# Altium schematic sheet Power ATX.SchDoc
size A3; SheetNumber: 2; SheetTotal: 15
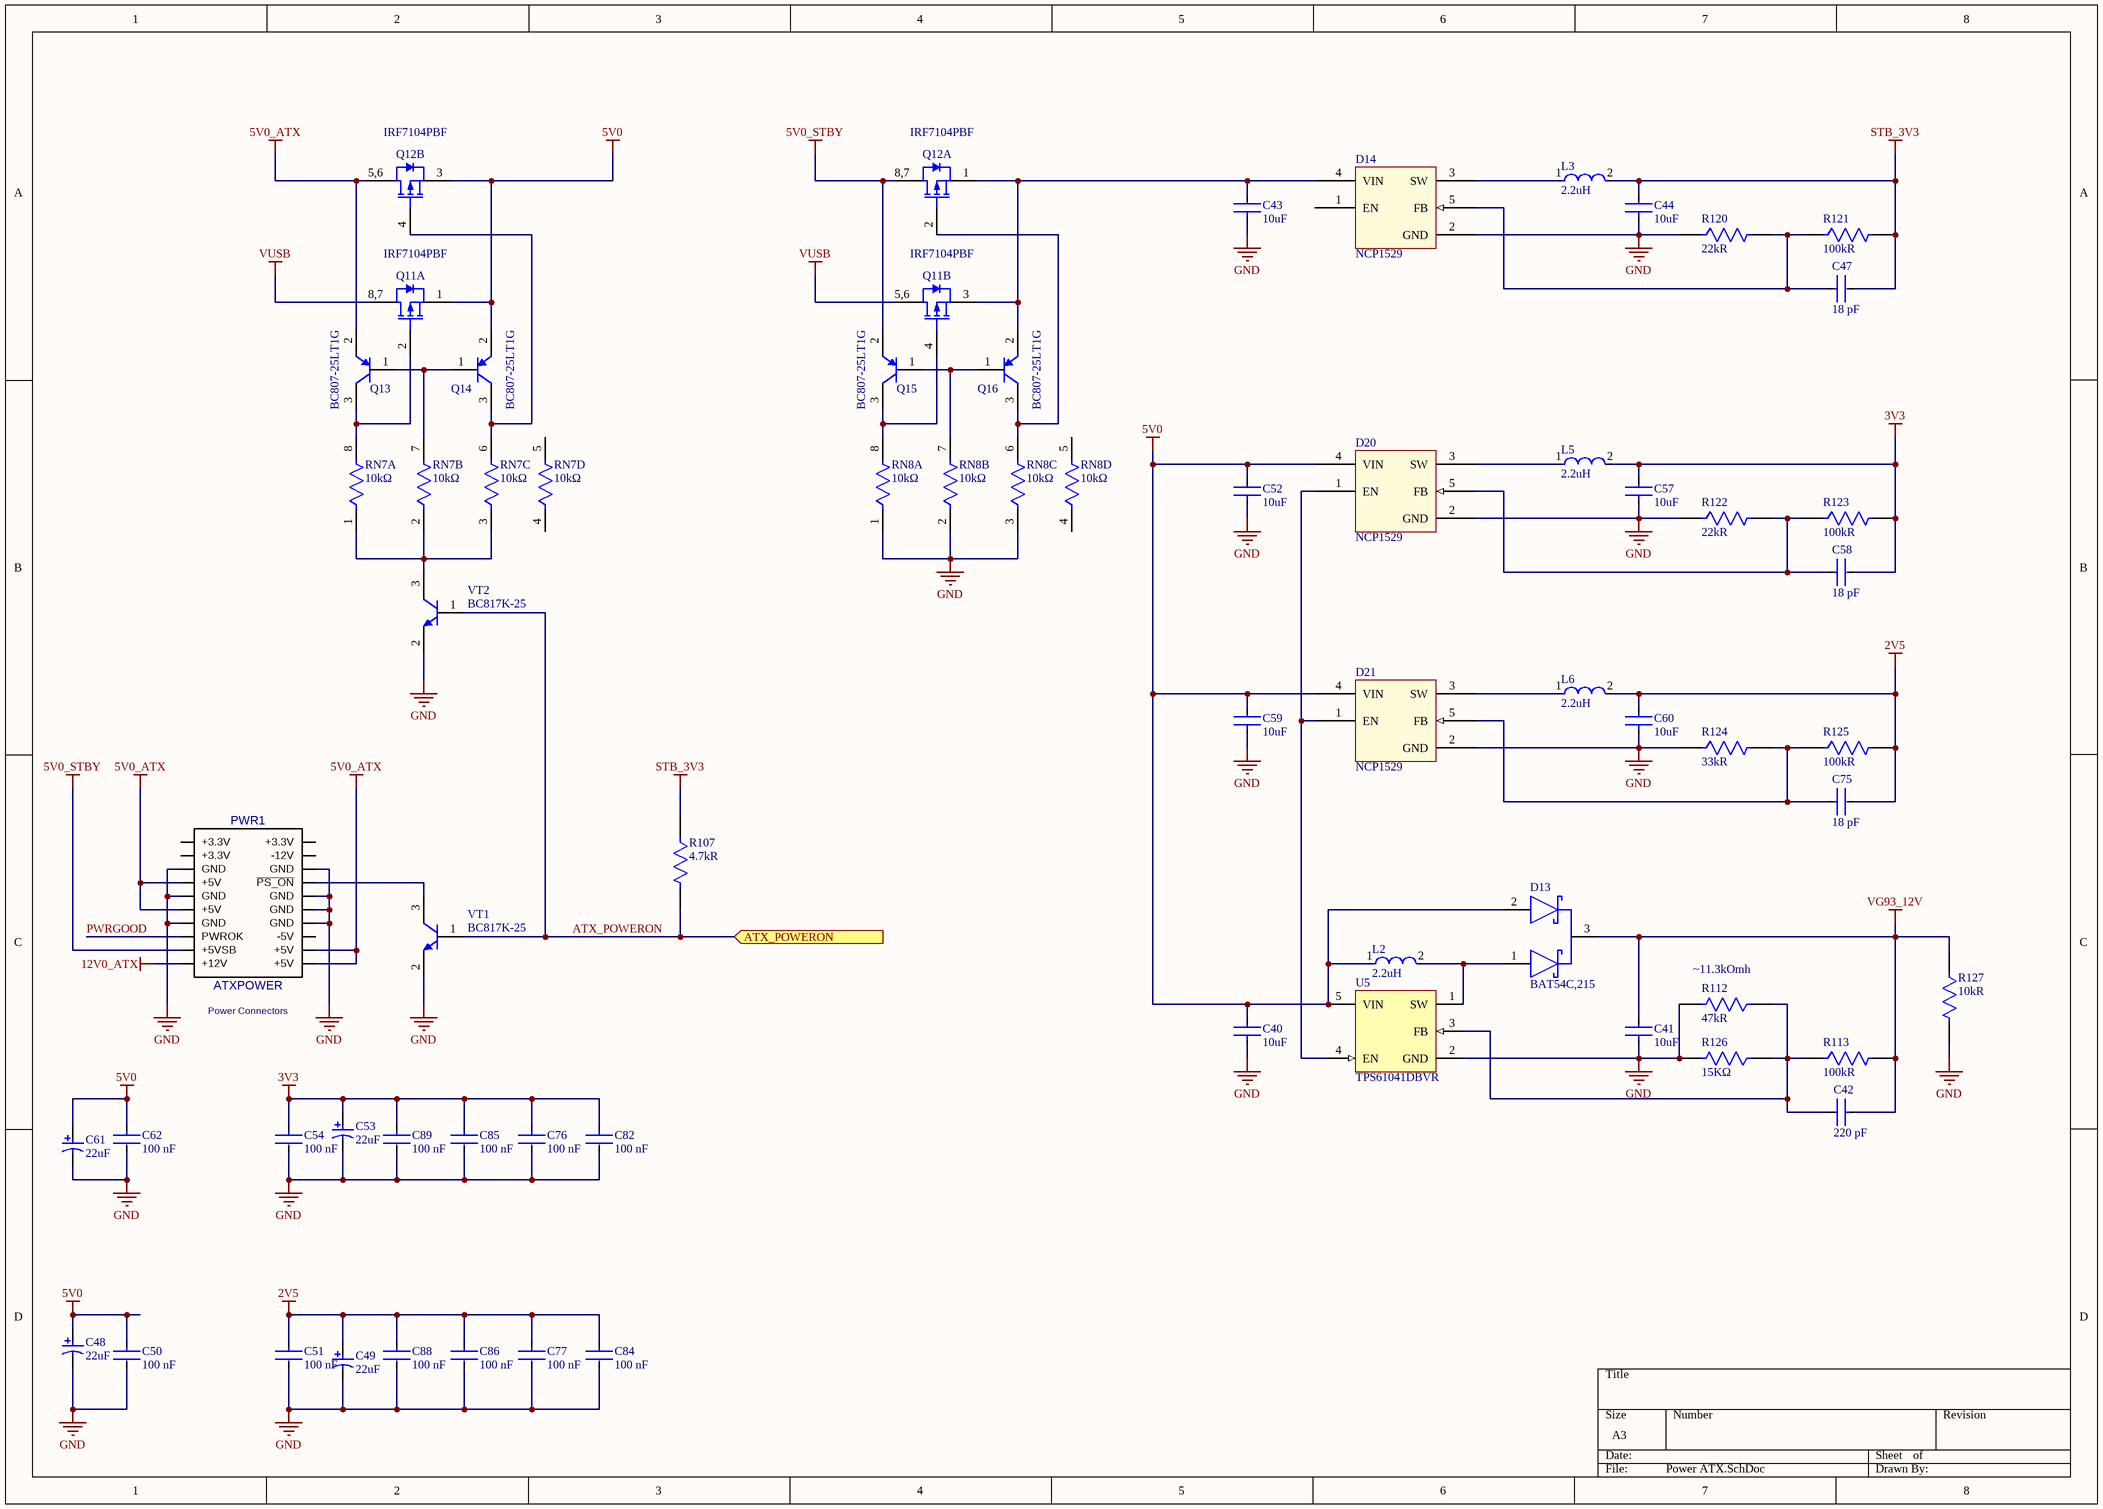
[diagram p0: Power ATX.SchDoc]

## Parts
C40  Capacitance: 10uF  [FP-C0805C-DG-IPC_A]  (hidden comment: C0805C106K8PACTU)
C41  Capacitance: 10uF  [FP-C0805C-DG-IPC_A]  (hidden comment: C0805C106K8PACTU)
C42  Capacitance: 220 pF  [FP-CC0805-0_85-IPC_A]  (hidden comment: CC0805KRX7R9BB221)
C43  Capacitance: 10uF  [FP-C0805C-DG-IPC_A]  (hidden comment: C0805C106K8PACTU)
C44  Capacitance: 10uF  [FP-C0805C-DG-IPC_A]  (hidden comment: C0805C106K8PACTU)
C47  Capacitance: 18 pF  [FP-C0805C-DN-IPC_A]  (hidden comment: C0805C180J5GACTU)
C48  Capacitance: 22uF  [AVX-TAJ-B-2_M]  (hidden comment: TAJB226K016RNJ)
C49  Capacitance: 22uF  [AVX-TAJ-B-2_M]  (hidden comment: TAJB226K016RNJ)
C50  Capacitance: 100 nF  [FP-CC0805-0_85-IPC_A]  (hidden comment: CC0805KRX7R9BB104)
C51  Capacitance: 100 nF  [FP-CC0805-0_85-IPC_A]  (hidden comment: CC0805KRX7R9BB104)
C52  Capacitance: 10uF  [FP-C0805C-DG-IPC_A]  (hidden comment: C0805C106K8PACTU)
C53  Capacitance: 22uF  [AVX-TAJ-B-2_M]  (hidden comment: TAJB226K016RNJ)
C54  Capacitance: 100 nF  [FP-CC0805-0_85-IPC_A]  (hidden comment: CC0805KRX7R9BB104)
C57  Capacitance: 10uF  [FP-C0805C-DG-IPC_A]  (hidden comment: C0805C106K8PACTU)
C58  Capacitance: 18 pF  [FP-C0805C-DN-IPC_A]  (hidden comment: C0805C180J5GACTU)
C59  Capacitance: 10uF  [FP-C0805C-DG-IPC_A]  (hidden comment: C0805C106K8PACTU)
C60  Capacitance: 10uF  [FP-C0805C-DG-IPC_A]  (hidden comment: C0805C106K8PACTU)
C61  Capacitance: 22uF  [AVX-TAJ-B-2_M]  (hidden comment: TAJB226K016RNJ)
C62  Capacitance: 100 nF  [FP-CC0805-0_85-IPC_A]  (hidden comment: CC0805KRX7R9BB104)
C75  Capacitance: 18 pF  [FP-C0805C-DN-IPC_A]  (hidden comment: C0805C180J5GACTU)
C76  Capacitance: 100 nF  [FP-CC0805-0_85-IPC_A]  (hidden comment: CC0805KRX7R9BB104)
C77  Capacitance: 100 nF  [FP-CC0805-0_85-IPC_A]  (hidden comment: CC0805KRX7R9BB104)
C82  Capacitance: 100 nF  [FP-CC0805-0_85-IPC_A]  (hidden comment: CC0805KRX7R9BB104)
C84  Capacitance: 100 nF  [FP-CC0805-0_85-IPC_A]  (hidden comment: CC0805KRX7R9BB104)
C85  Capacitance: 100 nF  [FP-CC0805-0_85-IPC_A]  (hidden comment: CC0805KRX7R9BB104)
C86  Capacitance: 100 nF  [FP-CC0805-0_85-IPC_A]  (hidden comment: CC0805KRX7R9BB104)
C88  Capacitance: 100 nF  [FP-CC0805-0_85-IPC_A]  (hidden comment: CC0805KRX7R9BB104)
C89  Capacitance: 100 nF  [FP-CC0805-0_85-IPC_A]  (hidden comment: CC0805KRX7R9BB104)
D13  BAT54C,215  [FP-SOT23-MFG]
D14  NCP1529  [TSOP-95-5N]
D20  NCP1529  [TSOP-95-5N]
D21  NCP1529  [TSOP-95-5N]
L2  Inductance: 2.2uH  [FP-DFE252012C-MFG]  (hidden comment: DFE252012P-2R2M=P2)
L3  Inductance: 2.2uH  [FP-DFE252012C-MFG]  (hidden comment: DFE252012P-2R2M=P2)
L5  Inductance: 2.2uH  [FP-DFE252012C-MFG]  (hidden comment: DFE252012P-2R2M=P2)
L6  Inductance: 2.2uH  [FP-DFE252012C-MFG]  (hidden comment: DFE252012P-2R2M=P2)
PWR1  ATXPOWER  [ATXPOWER]
Q11  IRF7104PBF  [SOIC127P600X155-8N]  (parts A,B of 2)
Q12  IRF7104PBF  [SOIC127P600X155-8N]  (parts A,B of 2)
Q13  BC807-25LT1G  [ONSC-SOT-23-3-318-08_V]
Q14  BC807-25LT1G  [ONSC-SOT-23-3-318-08_V]
Q15  BC807-25LT1G  [ONSC-SOT-23-3-318-08_V]
Q16  BC807-25LT1G  [ONSC-SOT-23-3-318-08_V]
R107  Resistance: 4.7kR  [FP-CR0805-IPC_A]  (hidden comment: CR0805-JW-472ELF)
R112  Resistance: 47kR  [FP-CRCW0805-HPe3-IPC_A]  (hidden comment: CRCW080547K0FKEAHP)
R113  Resistance: 100kR  [FP-ERA6A-IPC_A]  (hidden comment: ERA-6AEB104V)
R120  Resistance: 22kR  [FP-CRCW0805-e3-IPC_A]  (hidden comment: CRCW080522K0JNEA)
R121  Resistance: 100kR  [FP-ERA6A-IPC_A]  (hidden comment: ERA-6AEB104V)
R122  Resistance: 22kR  [FP-CRCW0805-e3-IPC_A]  (hidden comment: CRCW080522K0JNEA)
R123  Resistance: 100kR  [FP-ERA6A-IPC_A]  (hidden comment: ERA-6AEB104V)
R124  Resistance: 33kR  [FP-RMCF0805-IPC_A]  (hidden comment: RMCF0805JT33K0)
R125  Resistance: 100kR  [FP-ERA6A-IPC_A]  (hidden comment: ERA-6AEB104V)
R126  Resistance: 15KΩ  [FP-RN732A-IPC_A]  (hidden comment: RN73C2A15KBTDF)
R127  Resistance: 10kR  [FP-CR0805-IPC_A]  (hidden comment: CR0805-JW-103ELF)
RN7  Resistance: 10kΩ  [FP-CAT16-F4-MFG]  (hidden comment: CAT16-1002F4LF)  (parts A,B,C,D of 4)
RN8  Resistance: 10kΩ  [FP-CAT16-F4-MFG]  (hidden comment: CAT16-1002F4LF)  (parts A,B,C,D of 4)
U5  TPS61041DBVR  [DBV0005A_M]
VT1  BC817K-25  [INF-SOT23_N]
VT2  BC817K-25  [INF-SOT23_N]

## Ports
ATX_POWERON (in)

## Nets
2V5: C49.1 C51.1 C60.2 C75.2 C77.1 C84.1 C86.1 C88.1 L6.2 R125.2
3V3: C53.1 C54.1 C57.2 C58.2 C76.1 C82.1 C85.1 C89.1 L5.2 R123.2
5V0: C40.2 C48.1 C50.1 C52.2 C59.2 C61.1 C62.1 D13.2(2_ANODE) D20.4(VIN) D21.4(VIN) L2.1 Q11.1(SOURCE) Q12.3(SOURCE) Q14.2(E) U5.5(VIN)
5V0_ATX: PWR1.4(+5V) PWR1.6(+5V) PWR1.19(+5V) PWR1.20(+5V) Q12.5,6(DRAIN) Q13.2(E)
5V0_STBY: PWR1.9(+5VSB) Q12.8,7(DRAIN) Q15.2(E)
12V0_ATX: PWR1.10(+12V)
GND: C40.1 C41.1 C43.1 C44.1 C48.2 C49.2 C50.2 C51.2 C52.1 C53.2 C54.2 C57.1 C59.1 C60.1 C61.2 C62.2 C76.2 C77.2 C82.2 C84.2 C85.2 C86.2 C88.2 C89.2 D14.2(GND) D20.2(GND) D21.2(GND) PWR1.3(GND) PWR1.5(GND) PWR1.7(GND) PWR1.13(GND) PWR1.15(GND) PWR1.16(GND) PWR1.17(GND) R112.2 R120.1 R122.1 R124.1 R126.2 R127.2 RN8.1 RN8.2 RN8.3 U5.2(GND) VT1.2(E) VT2.2(E)
STB_3V3: C44.2 C47.2 L3.2 R107.1 R121.2
VG93_12V: C41.2 C42.1 D13.3(COMMON_CATHODE) R113.2 R127.1
VUSB: Q11.5,6(DRAIN) Q11.8,7(DRAIN)
ATX_POWERON: R107.2 VT1.1(B) VT2.1(B) ; port ATX_POWERON
PWRGOOD: PWR1.8(PWROK)
NetC42_2: C42.2 R112.1 R113.1 R126.1 U5.3(FB)
NetC43_2: C43.2 D14.4(VIN) Q11.3(SOURCE) Q12.1(SOURCE) Q16.2(E)
NetC47_1: C47.1 D14.5(FB) R120.2 R121.1
NetC58_1: C58.1 D20.5(FB) R122.2 R123.1
NetC75_1: C75.1 D21.5(FB) R124.2 R125.1
NetD13_1: D13.1(1_ANODE) L2.2 U5.1(SW)
NetD14_3: D14.3(SW) L3.1
NetD20_1: D20.1(EN) D21.1(EN) U5.4(EN)
NetD20_3: D20.3(SW) L5.1
NetD21_3: D21.3(SW) L6.1
NetPWR1_14: PWR1.14(~{PS_ON}) VT1.3(C)
NetQ11_2: Q11.2(GATE) Q13.3(C) RN7.8
NetQ11_4: Q11.4(GATE) Q15.3(C) RN8.8
NetQ12_2: Q12.2(GATE) Q16.3(C) RN8.6
NetQ12_4: Q12.4(GATE) Q14.3(C) RN7.6
NetQ13_1: Q13.1(B) Q14.1(B) RN7.7
NetQ15_1: Q15.1(B) Q16.1(B) RN8.7
NetRN7_1: RN7.1 RN7.2 RN7.3 VT2.3(C)

Not connected (* = marked no-connect by the designer): D14 1(EN); PWR1 1(+3.3V) 2(+3.3V) 11(+3.3V) 12(-12V) 18(-5V); RN7 4 5; RN8 4 5

## Notes on the sheet
- (near R112) ~11.3kOmh
- (near PWR1) Power Connectors

## Library data of the parts
C40 C41 C43 C44 C52 C57 C59 C60 = CMP-2007-03243-2: CAP CER 10UF 10V X5R 0805; Manufacturer: KEMET; Manufacturer Part Number: C0805C106K8PACTU; Value: 10uF; Category: Cap; Case/Package: 0805
C42 = CMP-1036-02315-3: CAP CER 220PF 50V X7R 0805; Manufacturer Part Number: VJ0805A221KXAPW1BC; Manufacturer: Vishay Vitramon; Value: 220 pF; Category: Cap; Case/Package: 0805
C47 C58 C75 = CMP-2007-00302-2: CAP CER 18PF 50V C0G/NP0 0805; Manufacturer: KEMET; Temperature Characteristic: C0G; Tolerance: 0.05; Material: Ceramic; Temperature Coefficient: 30ppm/°C; Device Class L2: Capacitors; Temperature: -55°C to +125°C; Value: 18 pF; Package: C0805C-DN; Mouser Description: Cap Ceramic 18pF 50V C0G 5% SMD 0805 125C Paper T/R; Height: 0.88mm; ComponentLink2URL: https://content.kemet.com/datasheets/KEM_C1003_C0G_SMD.pdf; RoHS: TRUE; Octopart: https://octopart.com/c0805c180j5gactu-kemet-144810; ComponentLink2Description: Datasheet; Temperature Range High: +125°C; Digikey Description: CAP CER 18PF 50V C0G/NP0 0805; Device Class L1: Passive Components; Category: Cap; Automotive: No; Device Class L3: Ceramic Capacitors; Voltage Rating: 50 V; Temperature Range Low: -55°C; Ipc Land Pattern Name: CAPC200125X78; Lead Free: Yes; Manufacturer Part Number: C0805C180J5GACTU
C48 C49 C53 C61 = CMP-2100-03689-1: Standard Tantalum, 22 uF, +/- 10%, 16 V, -55 to 125 degC, 2-Pin SMD (1210), RoHS, Tape and Reel; Manufacturer: Kyocera AVX; value: 22uF; Number of Pins: 2; Termination: SMD/SMT; Case/Package: 1210; Manufacturer Part Number: TAJB226K016RNJ; Category: Cap
C50 C51 C54 C62 C76 C77 C82 C84-C86 C88 C89 = CMP-2100-03606-3: CAP CER 0.1UF 50V X7R 0805; Manufacturer: Yageo; Value: 100 nF; Manufacturer Part Number: CC0805KRX7R9BB104; Category: Cap; Case/Package: 0805
D13 = CMP-14398-000007-1: DIODE ARRAY SCHOTTKY 30V SOT23; Manufacturer: Nexperia; Automotive Grade: Grade 0; Peak Reverse Current: 2uA; Forward Current: 200mA; Max Surge Forward Current: 600mA; Value: 10pF; Max Junction Temp: +150°C; Lead Free: Yes; Automotive: Yes; Device Class L1: Discrete Semiconductors; Digikey Description: DIODE ARRAY SCHOTTKY 30V SOT23; Reverse Voltage: 30V; ComponentLink2URL: https://assets.nexperia.com/documents/data-sheet/BAT54_SER.pdf; Device Class L2: Diodes; Category: Diode; Octopart: https://octopart.com/bat54c%2C215-nexperia-78738945; Package: SOT23; Mouser Description: Schottky Diodes, Rectifiers - Arrays SOT-23 (TO-236AB) 30V 200mA (DC) Surface Mount; RoHS: TRUE; Manufacturer Part Number: BAT54C,215; Temperature: to +150°C; Ambient Temperature Range Low: -55°C; Height: 1.1mm; Device Class L3: Schottky Diodes; Temperature Range High: +150°C; Footprint Url: https://assets.nexperia.com/documents/outline-drawing/SOT23.pdf; Capacitance: 10pF; Ambient Temperature Range High: +150°C; Ipc Land Pattern Name: SOT95P230X100-3; ComponentLink2Description: Datasheet
D14 D20 D21 = NCP1529ASNT1G: Buck Converter - DC-DC, / High Efficiency, Adjustable / Output Voltage, Low Ripple / 1.7 MHz, 1 A; Case/Package: TSOP-8; Mount: Surface Mount; Number of Pins: 5
L2 L3 L5 L6 = CMP-06042-014522-1: Shielded Wirewound Inductor 2.2uH 20% 2200mA 0.084Ω 1008 (2520); Max DC Current: 2.2A; Current Rating: 3A; Core Material: Ferrite; Test Frequency: 1MHz; DC Resistance (DCR): 84mR; Case/Package: 1008; Case Code (Metric): 2520; Resistor Type: Wirewound; Lead Free: Lead Free; Shielding: Shielded; Depth: 2mm; Case Code (Imperial): 1008; Packaging: Tape and Reel; Width: 0.079inch; Min Operating Temperature: -40°C; Height - Seated (Max): 0.039inch; Tolerance: 20%; Max Operating Temperature: 125°C; Mount: Surface Mount; Length: 0.098inch
PWR1 = ATXPOWER: Analogs: MF-20MA;N42GP-20; Value: ATXPOWER; Case/Package: Mini-Fit 20 PIN 5.2; Category: Connector
Q11 Q12 = IRF7104PBF: IRF7104PBF Dual P-channel MOSFET Transistor; 2.3 A; 20 V; 8-Pin SOIC; Continuous Drain Current (ID): 2.3 A; Drain to Source Breakdown Voltage: -20 V; Drain to Source Resistance: 250 mΩ; Gate to Source Voltage (Vgs): 12 V; Nominal Vgs: -3 V; Number of Elements: 2; Case/Package: SOIC; Mount: Surface Mount; Number of Pins: 8
Q13-Q16 = CMP-1048-00691-1: General Purpose Transistor, PNP Silicon, 3-Pin SOT-23, Pb-Free, Tape and Reel; Manufacturer: On Semiconductor; IC Continuous (A): -0.5; fT Min (MHz): 100; PackageDescription: 3-Pin Small Outline Transistor, Body 2.92 x 1.3 mm, Pitch 0.95 mm; Polarity: PNP; ComponentLink2URL: http://www.onsemi.com/pub_link/Collateral/BC807-16LT1-D.PDF; PackageReference: SOT-23-3-318-08; ComponentLink2Description: Datasheet; ComponentLink1Description: Manufacturer URL; PartNumber: BC807-25LT1G; ComponentLink3URL: http://www.onsemi.cn/pub_link/Collateral/318-08.PDF; Packing: Tape and Reel; DatasheetVersion: Rev. 10; RoHS: TRUE; ComponentLink3Description: Package Specification; PackageVersion: Rev. AP, 11/2009; ComponentLink1URL: http://www.onsemi.com/; Mounting Technology: Surface Mount
R107 = CMP-07231-004713-1: Thick Film Chip Resistors 0805 4.7kΩ 0.125W 5% 200ppm/°C; Manufacturer: Bourns; Case/Package: 0805; Number of Terminations: 2; Termination: SMD/SMT; Manufacturer Part Number: CR0805-JW-472ELF; value: 4.7kΩ; Category: Res
R112 = CMP-02407-008731-1: RES Thick Film, 47kΩ, 1%, 0.5W, 100ppm/°C, 0805; Manufacturer: Vishay; Number of Terminations: 2; Termination: SMD/SMT; Case/Package: 0805; Manufacturer Part Number: CRCW080547K0FKEAHP; value: 47kΩ; Category: Res
R113 R121 R123 R125 = CMP-2001-00583-2: RES 100K OHM 0.1% 1/8W 0805; Max Power Dissipation: 125mW; Voltage Rating: 100V; Temperature Coefficient: 25ppm/°C; Resistance Tolerance: 0.1%; Resistor Type: Thin Film; Mount: Surface Mount; Package Quantity: 1; RoHS Compliant: Yes; Features: Automotive AEC-Q200; Termination: Solder; Contact Plating: Tin; Number of Pins: 2; Construction: Rectangular; Size Code: 0805; Case/Package: 0805; Military Standard: Not; Voltage Rating (DC): 100V; Max Operating Temperature: 155°C; REACH SVHC: No SVHC; Series: ERA-6A; Case Code (Metric): 2012; Number of Terminations: 2; Tolerance: 0.1%; Width: 1.25mm; Depth: 1.25mm; Lead Free: Lead Free; Radiation Hardening: No; Length: 2mm; Technology: METAL FILM; Power Rating: 125mW; Min Operating Temperature: -55°C; Height: 0.5mm; Case Code (Imperial): 0805; Packaging: Tape and Reel
R120 R122 = CMP-02407-007310-1: RES Thick Film, 22kΩ, 5%, 0.125W, 200ppm/°C, 0805; Voltage Rating: 150V; Power Rating: 125mW; Width: 0.049inch; Packaging: Tape and Reel; Case Code (Imperial): 0805; Max Operating Temperature: 155°C; Tolerance: 5%; Number of Terminations: 2; Termination: SMD/SMT; Length: 2mm; Weight: 0.000194oz; Military Standard: Not; Contact Plating: Tin; Radiation Hardening: No; Depth: 1.25mm; Min Operating Temperature: -55°C; Max Power Dissipation: 125mW; Height: 0.02inch; Case Code (Metric): 2012; Temperature Coefficient: 200ppm/°C; Composition: Thick Film; Features: Automotive AEC-Q200; Package Quantity: 1; Voltage Rating (DC): 150V; Case/Package: 0805; Lead Free: Lead Free
R124 = CMP-26527-001097-1: 33kΩ ±5% 0.125W 0805 Thick Film Chip Resistor AEC-Q200 compliant; Manufacturer: Stackpole Electronics; Number of Terminations: 2; Case/Package: 0805; Manufacturer Part Number: RMCF0805JT33K0; value: 33kΩ; Category: Res
R126 = CMP-03211-008328-1: SMD Chip Resistor, Thin Film, 15KΩ, 100 V, 0805 [2012 Metric], 100 mW, 0.1%, RN73 Series; Manufacturer: TE Connectivity; Manufacturer Part Number: RN73C2A15KBTDF; Category: Res; Value: 15KΩ; Case/Package: 0805
R127 = CMP-07231-003873-1: Thick Film Chip Resistors 0805 10kΩ 0.125W 5% 200ppm/°C; Manufacturer: Bourns; value: 10kΩ; Manufacturer Part Number: CR0805-JW-103ELF; Number of Terminations: 2; Termination: SMD/SMT; Number of Pins: 2; Case/Package: 0805; Category: Res
RN7 RN8 = CMP-07230-000003-1: RES ARRAY 4 RES 10K OHM 1206; Manufacturer: Bourns; Voltage Rating: 50V; Power Rating: 0.25W; Tolerance: 1%; Number Of Resistors: 4; Value: 10kΩ; Temperature Coefficient: 200ppm/°C; Power Per Resistor: 0.0625W; Manufacturer Part Number: CAT16-1002F4LF; Category: Res; Termination: Concave; Series: CAT16; Height: 0.6mm; Device Class L2: Resistors; Digikey Description: RES ARRAY 4 RES 10K OHM 1206; ComponentLink2Description: Datasheet; Temperature Range High: +125°C; ComponentLink2URL: https://www.bourns.com/docs/Product-Datasheets/CATCAY.pdf; Temperature: -55°C to +125°C; Temperature Range Low: -55°C; Octopart: https://octopart.com/cat16-1002f4lf-bourns-1624551; Mouser Description: Resistor Networks & Arrays 10K 1% Concave 4resistors; RoHS: TRUE; Device Class L1: Passive Components; Lead Free: Yes; Automotive: No; Package: CAT16-F4; Device Class L3: Resistor Arrays
U5 = CMP-0388-00116-2: 28 V, 250 mA Switch Boost Converter for LCD and White LED Applications, 1.8 to 6 V, -40 to 85 degC, 5-pin SOT23 (DBV5), Green (RoHS & no Sb/Br); Manufacturer: Texas Instruments; SubFamily: White LED Driver; Vin(Max)(V): 6; Rating: Catalog; Switching Frequency(Max)(kHz): 1000; Dimming: TRUE; Iq(Typ)(mA): 0.028; Vin(Min)(V): 1.8; Iout(Max)(A): 0.05; PackageVersion: 4073253-4/K; PackageDescription: 5-Pin Plastic Small Outline, Body 1.60 Ãƒâ€” 2.90 mm, Pitch 0.95 mm; Mounting Technology: Surface Mount; Topology: Boost; ComponentLink2Description: Datasheet; DatasheetVersion: SLVS413F; ComponentLink3URL: http://www.ti.com/litv/pdf/mpds018i; ComponentLink3Description: Package Specification; Code_JEDEC: MO-178; Eco-Plan: Green (RoHS & no Sb/Br); ComponentLink1URL: http://www.ti.com/; ComponentLink2URL: http://www.ti.com/general/docs/lit/getliterature.tsp?genericPartNumber=TPS61041&fileType=pdf; PackageReference: DBV0005A; PartNumber: TPS61041DBVR; ComponentLink1Description: Manufacturer URL
VT1 VT2 = CMP-1177-00027-1: NPN Silicon AF Transistor, 45 V VCEO, 500 mA IC, SOT23, Reel, Green; Manufacturer: Infineon; PackageDescription: 3-Pin Small Outline Transistor Package, 1.3 x 2.9 mm Body, 0.95 mm Pitch; PartNumber: BC817K-25; Manufacturer Part Number: BC817K-25; value: BC817K-25; Case/Package: SOT-23; Category: Transistor